# Altium schematic sheet top.SchDoc: Graviton SDR
size Letter; CheckedBy: J. Brinton; CompanyName: Signal Laboratories, Inc.; DrawnBy: J. Brinton; Engineer: J. Brinton; Address1: 3479 Edison Way; Address2: Menlo Park CA 94025; Address3: +1 (877) 778-8435; Address4: siglabs.com; Revision: 3; SheetNumber: 1; SheetTotal: 49; ModifiedDate: 4/20/2018
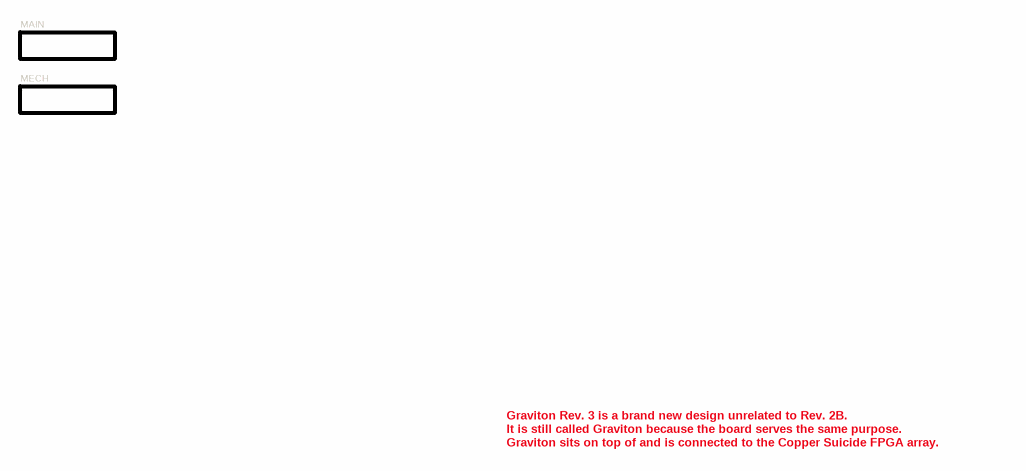
[diagram p0: top.SchDoc]

## Sub-sheets
MAIN = main.SchDoc: no entries
MECH = mechanical.SchDoc: no entries

## Notes on the sheet
- Graviton Rev. 3 is a brand new design unrelated to Rev. 2B.
- It is still called Graviton because the board serves the same purpose.
- Graviton sits on top of and is connected to the Copper Suicide FPGA array.
- Title
- Engineer
- Revision
- Drawn By
- Checked By
- Date
- Sheet
- of